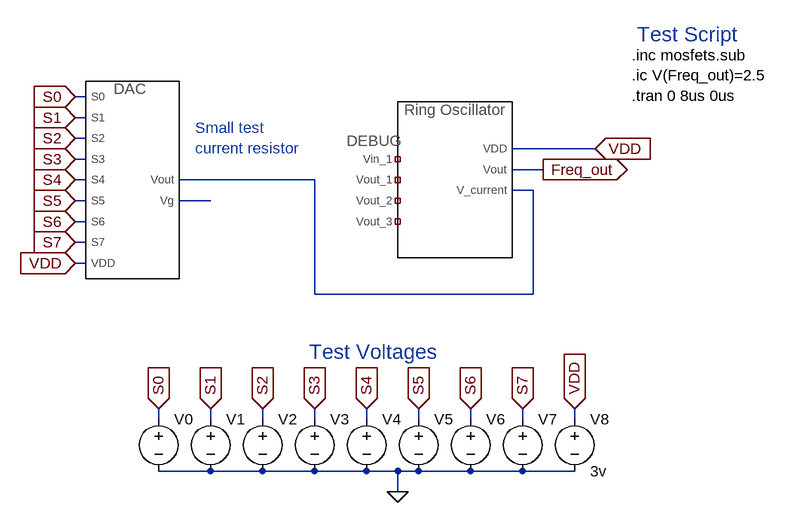
[diagram p0: schematic 0_winterg_assembly.asc]
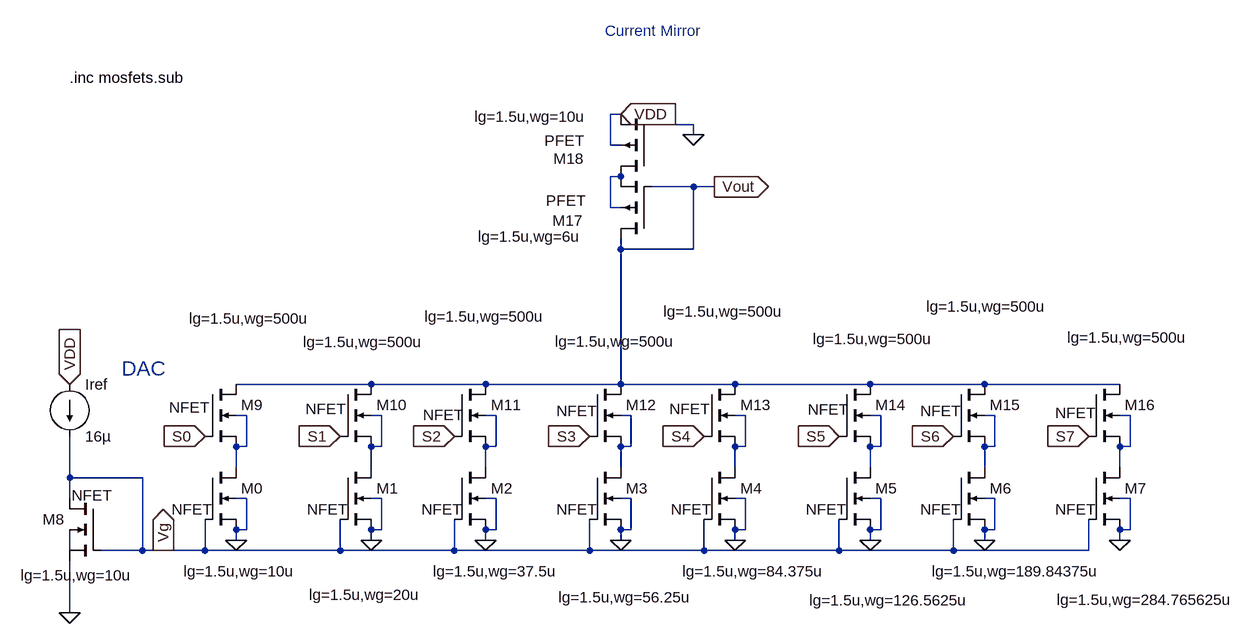
[diagram p1: sub-circuit 3_dac_winterg.asc]
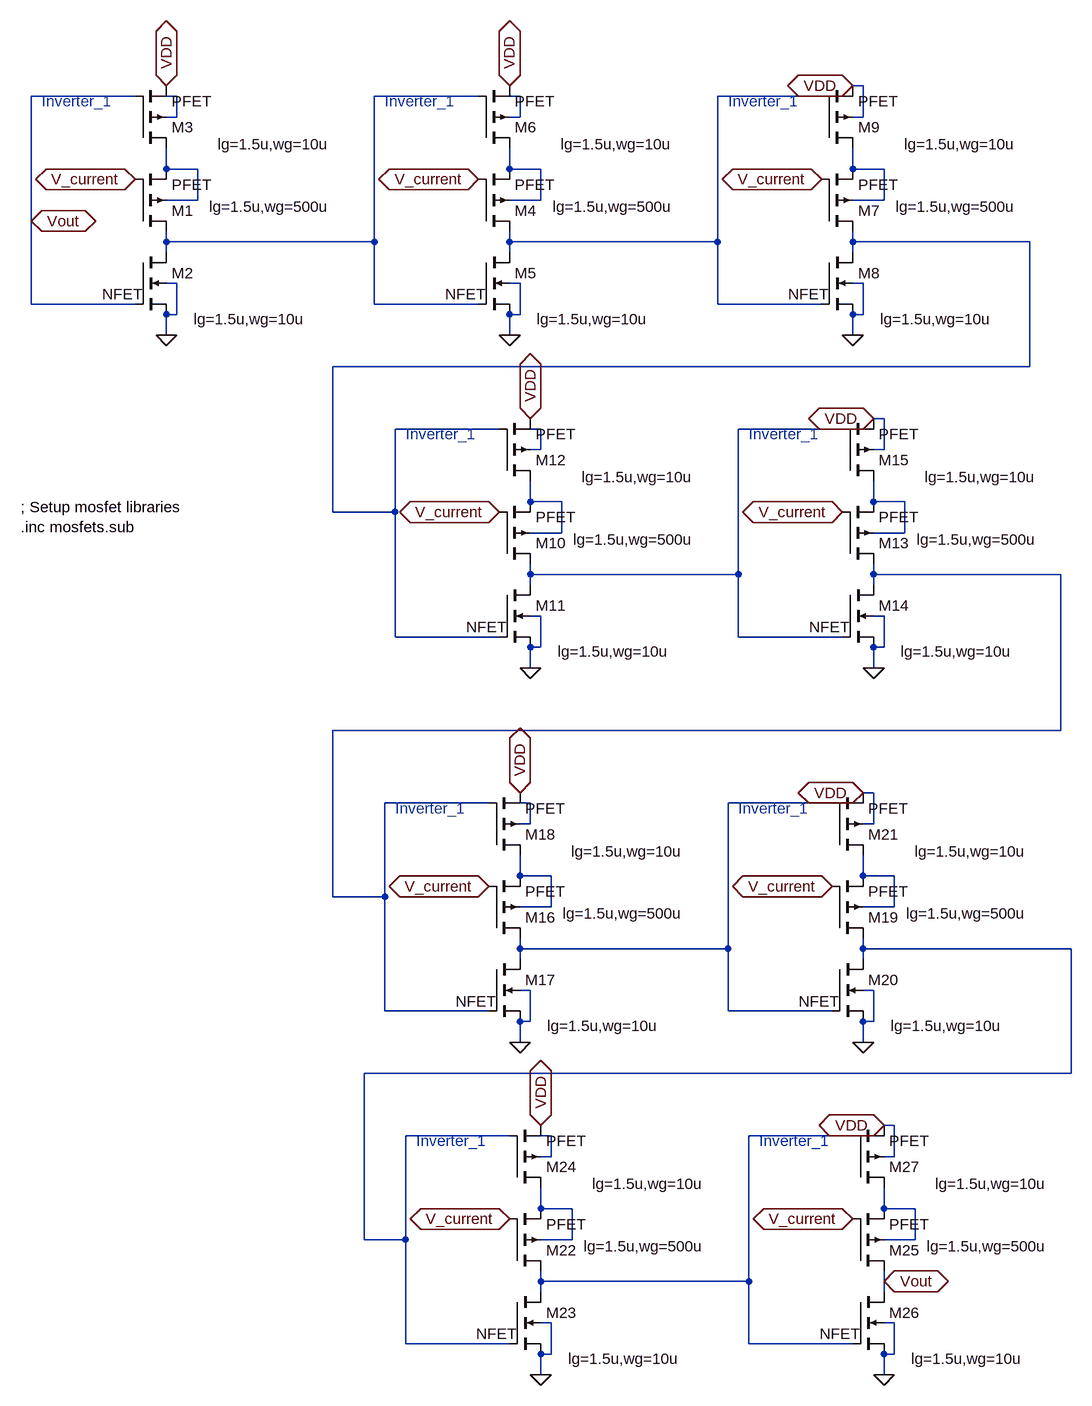
[diagram p2: sub-circuit 2_oscillator_winterg.asc]
0_winterg_assembly.asc, the LTspice schematic file:
Version 4
SHEET 1 1016 1228
WIRE -176 272 -192 272
WIRE -176 304 -192 304
WIRE -176 336 -192 336
WIRE 608 352 480 352
WIRE -176 368 -192 368
WIRE 528 384 480 384
WIRE -176 400 -192 400
WIRE 176 400 -32 400
WIRE 512 416 480 416
WIRE -176 432 -192 432
WIRE 16 432 -32 432
WIRE -176 464 -192 464
WIRE -176 496 -192 496
WIRE -176 528 -192 528
WIRE 176 576 176 400
WIRE 512 576 512 416
WIRE 512 576 176 576
WIRE -64 768 -64 752
WIRE 16 768 16 752
WIRE 96 768 96 752
WIRE 176 768 176 752
WIRE 256 768 256 752
WIRE 336 768 336 752
WIRE 416 768 416 752
WIRE 496 768 496 752
WIRE 576 768 576 752
WIRE 16 848 -64 848
WIRE 96 848 16 848
WIRE 176 848 96 848
WIRE 256 848 176 848
WIRE 304 848 256 848
WIRE 336 848 304 848
WIRE 416 848 336 848
WIRE 496 848 416 848
WIRE 576 848 496 848
WIRE 304 880 304 848
FLAG -192 528 VDD
IOPIN -192 528 In
FLAG 608 352 VDD
IOPIN 608 352 In
FLAG 528 384 Freq_out
IOPIN 528 384 Out
FLAG -192 496 S7
IOPIN -192 496 In
FLAG -192 464 S6
IOPIN -192 464 In
FLAG -192 432 S5
IOPIN -192 432 In
FLAG -192 400 S4
IOPIN -192 400 In
FLAG -192 368 S3
IOPIN -192 368 In
FLAG -192 336 S2
IOPIN -192 336 In
FLAG -192 304 S1
IOPIN -192 304 In
FLAG -192 272 S0
IOPIN -192 272 In
FLAG 304 880 0
FLAG 576 752 VDD
IOPIN 576 752 In
FLAG -64 752 S0
IOPIN -64 752 In
FLAG 16 752 S1
IOPIN 16 752 In
FLAG 96 752 S2
IOPIN 96 752 In
FLAG 176 752 S3
IOPIN 176 752 In
FLAG 256 752 S4
IOPIN 256 752 In
FLAG 336 752 S5
IOPIN 336 752 In
FLAG 416 752 S6
IOPIN 416 752 In
FLAG 496 752 S7
IOPIN 496 752 In
SYMBOL 3_DAC_winterg -112 400 R0
WINDOW 0 8 -152 Invisible 2
WINDOW 39 -27 165 Left 2
SYMATTR InstName X1
SYMBOL 2_oscillator_winterg 384 400 R0
WINDOW 0 8 -120 Invisible 2
SYMATTR InstName X2
SYMBOL voltage -64 752 R0
WINDOW 3 24 38 Invisible 2
SYMATTR Value PULSE(0 3 0 1ns 1ns 1us 0.0 1)
SYMATTR InstName V0
SYMBOL voltage 16 752 R0
WINDOW 3 24 96 Invisible 2
SYMATTR Value PULSE(0 3 1us 1ns 1ns 1us 0 1)
SYMATTR InstName V1
SYMBOL voltage 96 752 R0
WINDOW 3 24 96 Invisible 2
SYMATTR Value PULSE(0 3 2us 1ns 1ns 1us 0 1)
SYMATTR InstName V2
SYMBOL voltage 176 752 R0
WINDOW 3 24 96 Invisible 2
SYMATTR Value PULSE(0 3 3us 1ns 1ns 1us 0 1)
SYMATTR InstName V3
SYMBOL voltage 256 752 R0
WINDOW 3 24 96 Invisible 2
SYMATTR Value PULSE(0 3 4us 1ns 1ns 1us 0 1)
SYMATTR InstName V4
SYMBOL voltage 336 752 R0
WINDOW 3 24 96 Invisible 2
SYMATTR InstName V5
SYMATTR Value PULSE(0 3 5us 1ns 1ns 1us 0 1)
SYMBOL voltage 416 752 R0
WINDOW 3 24 96 Invisible 2
SYMATTR InstName V6
SYMATTR Value PULSE(0 3 6us 1ns 1ns 1us 0 1)
SYMBOL voltage 496 752 R0
WINDOW 3 24 96 Invisible 2
SYMATTR InstName V7
SYMATTR Value PULSE(0 3 7us 1ns 1ns 1us 0 1)
SYMBOL voltage 576 752 R0
SYMATTR InstName V8
SYMATTR Value 3v
SYMATTR SpiceLine Rser=0
TEXT 664 208 Left 2 !.inc mosfets.sub\n.ic V(Freq_out)=2.5\n.tran 0 8us 0us
TEXT 168 664 Left 3 ;Test Voltages
TEXT 672 176 Left 3 ;Test Script
TEXT -8 320 Left 2 ;Small test\ncurrent resistor

3_dac_winterg.asc, the sub-circuit schematic file:
Version 4
SHEET 1 1748 680
WIRE 784 -240 768 -240
WIRE 896 -224 832 -224
WIRE 896 -208 896 -224
WIRE 768 -192 768 -240
WIRE 784 -192 768 -192
WIRE 784 -144 768 -144
WIRE 896 -128 832 -128
WIRE 928 -128 896 -128
WIRE 768 -96 768 -144
WIRE 784 -96 768 -96
WIRE 784 -32 784 -48
WIRE 896 -32 896 -128
WIRE 896 -32 784 -32
WIRE 400 176 192 176
WIRE 576 176 400 176
WIRE 784 176 784 -32
WIRE 784 176 576 176
WIRE 960 176 784 176
WIRE 1168 176 960 176
WIRE 1344 176 1168 176
WIRE 1552 176 1344 176
WIRE 208 224 192 224
WIRE 416 224 400 224
WIRE 592 224 576 224
WIRE 800 224 784 224
WIRE 976 224 960 224
WIRE 1184 224 1168 224
WIRE 1360 224 1344 224
WIRE 1568 224 1552 224
WIRE 208 272 208 224
WIRE 208 272 192 272
WIRE 416 272 416 224
WIRE 416 272 400 272
WIRE 592 272 592 224
WIRE 592 272 576 272
WIRE 800 272 800 224
WIRE 800 272 784 272
WIRE 976 272 976 224
WIRE 976 272 960 272
WIRE 1184 272 1184 224
WIRE 1184 272 1168 272
WIRE 1360 272 1360 224
WIRE 1360 272 1344 272
WIRE 1568 272 1568 224
WIRE 1568 272 1552 272
WIRE 192 304 192 272
WIRE 400 304 400 272
WIRE 576 304 576 272
WIRE 784 304 784 272
WIRE 960 304 960 272
WIRE 1168 304 1168 272
WIRE 1344 304 1344 272
WIRE 1552 304 1552 272
WIRE -64 320 -64 256
WIRE 48 320 -64 320
WIRE -64 352 -64 320
WIRE 208 352 192 352
WIRE 416 352 400 352
WIRE 592 352 576 352
WIRE 800 352 784 352
WIRE 976 352 960 352
WIRE 1184 352 1168 352
WIRE 1360 352 1344 352
WIRE 1568 352 1552 352
WIRE 208 400 208 352
WIRE 208 400 192 400
WIRE 416 400 416 352
WIRE 416 400 400 400
WIRE 592 400 592 352
WIRE 592 400 576 400
WIRE 800 400 800 352
WIRE 800 400 784 400
WIRE 976 400 976 352
WIRE 976 400 960 400
WIRE 1184 400 1184 352
WIRE 1184 400 1168 400
WIRE 1360 400 1360 352
WIRE 1360 400 1344 400
WIRE 1568 400 1568 352
WIRE 1568 400 1552 400
WIRE 192 416 192 400
WIRE 208 416 192 416
WIRE 400 416 400 400
WIRE 576 416 576 400
WIRE 784 416 784 400
WIRE 960 416 960 400
WIRE 1168 416 1168 400
WIRE 1344 416 1344 400
WIRE 1552 416 1552 400
WIRE -64 432 -64 400
WIRE 48 432 48 320
WIRE 48 432 -16 432
WIRE 80 432 48 432
WIRE 144 432 144 384
WIRE 144 432 80 432
WIRE 352 432 352 384
WIRE 352 432 144 432
WIRE 528 432 528 384
WIRE 528 432 352 432
WIRE 736 432 736 384
WIRE 736 432 528 432
WIRE 912 432 912 384
WIRE 912 432 736 432
WIRE 1120 432 1120 384
WIRE 1120 432 912 432
WIRE 1296 432 1296 384
WIRE 1296 432 1120 432
WIRE 1504 432 1504 384
WIRE 1504 432 1296 432
WIRE -64 528 -64 448
FLAG -64 176 VDD
IOPIN -64 176 In
FLAG -64 528 0
FLAG 192 416 0
FLAG 400 416 0
FLAG 576 416 0
FLAG 784 416 0
FLAG 960 416 0
FLAG 1168 416 0
FLAG 1344 416 0
FLAG 1552 416 0
FLAG 144 256 S0
IOPIN 144 256 In
FLAG 352 256 S1
IOPIN 352 256 In
FLAG 528 256 S2
IOPIN 528 256 In
FLAG 736 256 S3
IOPIN 736 256 In
FLAG 912 256 S4
IOPIN 912 256 In
FLAG 1120 256 S5
IOPIN 1120 256 In
FLAG 1296 256 S6
IOPIN 1296 256 In
FLAG 1504 256 S7
IOPIN 1504 256 In
FLAG 928 -128 Vout
IOPIN 928 -128 Out
FLAG 784 -240 VDD
IOPIN 784 -240 In
FLAG 896 -208 0
FLAG 80 432 Vg
IOPIN 80 432 Out
SYMBOL current -64 176 R0
SYMATTR InstName Iref
SYMATTR Value 16µ
SYMBOL nmos4 -16 352 M0
WINDOW 123 -49 118 Left 2
WINDOW 3 -18 -5 Left 2
SYMATTR Value2 lg=1.5u,wg=10u
SYMATTR Value NFET
SYMATTR InstName M8
SYMATTR Prefix X
SYMBOL nmos4 144 304 R0
WINDOW 123 -33 160 Left 2
WINDOW 3 -51 65 Left 2
SYMATTR Value2 lg=1.5u,wg=10u
SYMATTR Value NFET
SYMATTR InstName M0
SYMATTR Prefix X
SYMBOL nmos4 352 304 R0
WINDOW 123 -48 196 Left 2
WINDOW 3 -51 65 Left 2
SYMATTR Value2 lg=1.5u,wg=20u
SYMATTR Value NFET
SYMATTR InstName M1
SYMATTR Prefix X
SYMBOL nmos4 528 304 R0
WINDOW 123 -33 160 Left 2
WINDOW 3 -51 65 Left 2
SYMATTR Value2 lg=1.5u,wg=37.5u
SYMATTR Value NFET
SYMATTR InstName M2
SYMATTR Prefix X
SYMBOL nmos4 736 304 R0
WINDOW 123 -48 200 Left 2
WINDOW 3 -51 65 Left 2
SYMATTR Value2 lg=1.5u,wg=56.25u
SYMATTR Value NFET
SYMATTR InstName M3
SYMATTR Prefix X
SYMBOL nmos4 912 304 R0
WINDOW 123 -33 160 Left 2
WINDOW 3 -51 65 Left 2
SYMATTR Value2 lg=1.5u,wg=84.375u
SYMATTR Value NFET
SYMATTR InstName M4
SYMATTR Prefix X
SYMBOL nmos4 1120 304 R0
WINDOW 123 -46 205 Left 2
WINDOW 3 -51 65 Left 2
SYMATTR Value2 lg=1.5u,wg=126.5625u
SYMATTR Value NFET
SYMATTR InstName M5
SYMATTR Prefix X
SYMBOL nmos4 1296 304 R0
WINDOW 123 -33 160 Left 2
WINDOW 3 -51 65 Left 2
SYMATTR Value2 lg=1.5u,wg=189.84375u
SYMATTR Value NFET
SYMATTR InstName M6
SYMATTR Prefix X
SYMBOL nmos4 1504 304 R0
WINDOW 123 -49 204 Left 2
WINDOW 3 -51 65 Left 2
SYMATTR Value2 lg=1.5u,wg=284.765625u
SYMATTR Value NFET
SYMATTR InstName M7
SYMATTR Prefix X
SYMBOL nmos4 144 176 R0
WINDOW 123 -24 -101 Left 2
WINDOW 3 -55 36 Left 2
SYMATTR Value2 lg=1.5u,wg=500u
SYMATTR Value NFET
SYMATTR InstName M9
SYMATTR Prefix X
SYMBOL nmos4 352 176 R0
WINDOW 123 -57 -65 Left 2
WINDOW 3 -53 38 Left 2
SYMATTR Value2 lg=1.5u,wg=500u
SYMATTR Value NFET
SYMATTR InstName M10
SYMATTR Prefix X
SYMBOL nmos4 528 176 R0
WINDOW 123 -46 -104 Left 2
WINDOW 3 -48 47 Left 2
SYMATTR Value2 lg=1.5u,wg=500u
SYMATTR Value NFET
SYMATTR InstName M11
SYMATTR Prefix X
SYMBOL nmos4 736 176 R0
WINDOW 123 -53 -66 Left 2
WINDOW 3 -51 41 Left 2
SYMATTR Value2 lg=1.5u,wg=500u
SYMATTR Value NFET
SYMATTR InstName M12
SYMATTR Prefix X
SYMBOL nmos4 912 176 R0
WINDOW 123 -62 -112 Left 2
WINDOW 3 -53 38 Left 2
SYMATTR Value2 lg=1.5u,wg=500u
SYMATTR Value NFET
SYMATTR InstName M13
SYMATTR Prefix X
SYMBOL nmos4 1120 176 R0
WINDOW 123 -40 -70 Left 2
WINDOW 3 -48 39 Left 2
SYMATTR Value2 lg=1.5u,wg=500u
SYMATTR Value NFET
SYMATTR InstName M14
SYMATTR Prefix X
SYMBOL nmos4 1296 176 R0
WINDOW 123 -42 -120 Left 2
WINDOW 3 -51 41 Left 2
SYMATTR Value2 lg=1.5u,wg=500u
SYMATTR Value NFET
SYMATTR InstName M15
SYMATTR Prefix X
SYMBOL nmos4 1504 176 R0
WINDOW 123 -33 -72 Left 2
WINDOW 3 -51 44 Left 2
SYMATTR Value2 lg=1.5u,wg=500u
SYMATTR Value NFET
SYMATTR InstName M16
SYMATTR Prefix X
SYMBOL pmos4 832 -48 R180
WINDOW 123 109 3 Left 2
WINDOW 0 106 28 Left 2
WINDOW 3 102 59 Left 2
SYMATTR Value2 lg=1.5u,wg=6u
SYMATTR InstName M17
SYMATTR Value PFET
SYMATTR Prefix X
SYMBOL pmos4 832 -144 R180
WINDOW 123 101 92 Left 2
WINDOW 0 104 27 Left 2
WINDOW 3 104 55 Left 2
SYMATTR Value2 lg=1.5u,wg=10u
SYMATTR InstName M18
SYMATTR Value PFET
SYMATTR Prefix X
TEXT -64 -296 Left 2 !.inc mosfets.sub
TEXT 760 -368 Left 2 ;Current Mirror
TEXT 16 152 Left 3 ;DAC

2_oscillator_winterg.asc, the sub-circuit schematic file:
Version 4
SHEET 1 2644 1360
WIRE 896 -640 880 -640
WIRE -224 -624 -384 -624
WIRE -160 -624 -176 -624
WIRE 304 -624 144 -624
WIRE 352 -624 352 -640
WIRE 368 -624 352 -624
WIRE 832 -624 672 -624
WIRE -160 -592 -160 -624
WIRE -160 -592 -176 -592
WIRE 368 -592 368 -624
WIRE 368 -592 352 -592
WIRE 896 -592 896 -640
WIRE 896 -592 880 -592
WIRE -176 -512 -176 -544
WIRE -128 -512 -176 -512
WIRE 352 -512 352 -544
WIRE 400 -512 352 -512
WIRE 880 -512 880 -544
WIRE 928 -512 880 -512
WIRE -128 -464 -128 -512
WIRE -128 -464 -176 -464
WIRE 400 -464 400 -512
WIRE 400 -464 352 -464
WIRE 928 -464 928 -512
WIRE 928 -464 880 -464
WIRE -384 -432 -384 -624
WIRE -176 -400 -176 -416
WIRE 144 -400 144 -624
WIRE 144 -400 -176 -400
WIRE 352 -400 352 -416
WIRE 672 -400 672 -624
WIRE 672 -400 352 -400
WIRE 880 -400 880 -416
WIRE 1152 -400 880 -400
WIRE -176 -384 -176 -400
WIRE 352 -384 352 -400
WIRE 880 -384 880 -400
WIRE -160 -336 -176 -336
WIRE 368 -336 352 -336
WIRE 896 -336 880 -336
WIRE -384 -304 -384 -432
WIRE -224 -304 -384 -304
WIRE 144 -304 144 -400
WIRE 304 -304 144 -304
WIRE 672 -304 672 -400
WIRE 832 -304 672 -304
WIRE -160 -288 -160 -336
WIRE -160 -288 -176 -288
WIRE 368 -288 368 -336
WIRE 368 -288 352 -288
WIRE 896 -288 896 -336
WIRE 896 -288 880 -288
WIRE -176 -256 -176 -288
WIRE 352 -256 352 -288
WIRE 880 -256 880 -288
WIRE 1152 -208 1152 -400
WIRE 1152 -208 80 -208
WIRE 928 -128 912 -128
WIRE 336 -112 176 -112
WIRE 384 -112 384 -128
WIRE 400 -112 384 -112
WIRE 864 -112 704 -112
WIRE 400 -80 400 -112
WIRE 400 -80 384 -80
WIRE 928 -80 928 -128
WIRE 928 -80 912 -80
WIRE 384 0 384 -32
WIRE 432 0 384 0
WIRE 912 0 912 -32
WIRE 960 0 912 0
WIRE 80 16 80 -208
WIRE 176 16 176 -112
WIRE 176 16 80 16
WIRE 432 48 432 0
WIRE 432 48 384 48
WIRE 960 48 960 0
WIRE 960 48 912 48
WIRE 384 112 384 96
WIRE 704 112 704 -112
WIRE 704 112 384 112
WIRE 912 112 912 96
WIRE 1200 112 912 112
WIRE 384 128 384 112
WIRE 912 128 912 112
WIRE 400 176 384 176
WIRE 928 176 912 176
WIRE 176 208 176 16
WIRE 336 208 176 208
WIRE 704 208 704 112
WIRE 864 208 704 208
WIRE 400 224 400 176
WIRE 400 224 384 224
WIRE 928 224 928 176
WIRE 928 224 912 224
WIRE 384 256 384 224
WIRE 912 256 912 224
WIRE 1200 352 1200 112
WIRE 1200 352 80 352
WIRE 912 448 896 448
WIRE 320 464 160 464
WIRE 368 464 368 448
WIRE 384 464 368 464
WIRE 848 464 688 464
WIRE 384 496 384 464
WIRE 384 496 368 496
WIRE 912 496 912 448
WIRE 912 496 896 496
WIRE 368 576 368 544
WIRE 416 576 368 576
WIRE 896 576 896 544
WIRE 944 576 896 576
WIRE 80 608 80 352
WIRE 160 608 160 464
WIRE 160 608 80 608
WIRE 416 624 416 576
WIRE 416 624 368 624
WIRE 944 624 944 576
WIRE 944 624 896 624
WIRE 368 688 368 672
WIRE 688 688 688 464
WIRE 688 688 368 688
WIRE 896 688 896 672
WIRE 1216 688 896 688
WIRE 368 704 368 688
WIRE 896 704 896 688
WIRE 384 752 368 752
WIRE 912 752 896 752
WIRE 160 784 160 608
WIRE 320 784 160 784
WIRE 688 784 688 688
WIRE 848 784 688 784
WIRE 384 800 384 752
WIRE 384 800 368 800
WIRE 912 800 912 752
WIRE 912 800 896 800
WIRE 368 832 368 800
WIRE 896 832 896 800
WIRE 1216 880 1216 688
WIRE 1216 880 128 880
WIRE 944 960 928 960
WIRE 352 976 192 976
WIRE 400 976 400 960
WIRE 416 976 400 976
WIRE 880 976 720 976
WIRE 416 1008 416 976
WIRE 416 1008 400 1008
WIRE 944 1008 944 960
WIRE 944 1008 928 1008
WIRE 400 1088 400 1056
WIRE 448 1088 400 1088
WIRE 928 1088 928 1056
WIRE 976 1088 928 1088
WIRE 128 1136 128 880
WIRE 192 1136 192 976
WIRE 192 1136 128 1136
WIRE 448 1136 448 1088
WIRE 448 1136 400 1136
WIRE 976 1136 976 1088
WIRE 976 1136 928 1136
WIRE 400 1200 400 1184
WIRE 720 1200 720 976
WIRE 720 1200 400 1200
WIRE 928 1200 928 1184
WIRE 400 1216 400 1200
WIRE 928 1216 928 1200
WIRE 416 1264 400 1264
WIRE 944 1264 928 1264
WIRE 192 1296 192 1136
WIRE 352 1296 192 1296
WIRE 720 1296 720 1200
WIRE 880 1296 720 1296
WIRE 416 1312 416 1264
WIRE 416 1312 400 1312
WIRE 944 1312 944 1264
WIRE 944 1312 928 1312
WIRE 400 1344 400 1312
WIRE 928 1344 928 1312
FLAG -176 -256 0
FLAG -176 -640 VDD
IOPIN -176 -640 BiDir
FLAG -224 -496 V_current
IOPIN -224 -496 BiDir
FLAG -384 -432 Vout
IOPIN -384 -432 BiDir
FLAG 352 -256 0
FLAG 352 -640 VDD
IOPIN 352 -640 BiDir
FLAG 304 -496 V_current
IOPIN 304 -496 BiDir
FLAG 880 -256 0
FLAG 880 -640 VDD
IOPIN 880 -640 BiDir
FLAG 832 -496 V_current
IOPIN 832 -496 BiDir
FLAG 384 256 0
FLAG 384 -128 VDD
IOPIN 384 -128 BiDir
FLAG 336 16 V_current
IOPIN 336 16 BiDir
FLAG 912 256 0
FLAG 912 -128 VDD
IOPIN 912 -128 BiDir
FLAG 864 16 V_current
IOPIN 864 16 BiDir
FLAG 368 832 0
FLAG 368 448 VDD
IOPIN 368 448 BiDir
FLAG 320 592 V_current
IOPIN 320 592 BiDir
FLAG 896 832 0
FLAG 896 448 VDD
IOPIN 896 448 BiDir
FLAG 848 592 V_current
IOPIN 848 592 BiDir
FLAG 928 1200 Vout
IOPIN 928 1200 BiDir
FLAG 400 1344 0
FLAG 400 960 VDD
IOPIN 400 960 BiDir
FLAG 352 1104 V_current
IOPIN 352 1104 BiDir
FLAG 928 1344 0
FLAG 928 960 VDD
IOPIN 928 960 BiDir
FLAG 880 1104 V_current
IOPIN 880 1104 BiDir
SYMBOL pmos4 -224 -416 M180
WINDOW 123 114 38 Left 2
SYMATTR Value2 lg=1.5u,wg=500u
SYMATTR InstName M1
SYMATTR Value PFET
SYMATTR Prefix X
SYMBOL nmos4 -224 -384 R0
WINDOW 123 90 103 Left 2
WINDOW 3 -51 65 Left 2
SYMATTR Value2 lg=1.5u,wg=10u
SYMATTR Value NFET
SYMATTR InstName M2
SYMATTR Prefix X
SYMBOL pmos4 -224 -544 M180
WINDOW 123 127 6 Left 2
SYMATTR Value2 lg=1.5u,wg=10u
SYMATTR InstName M3
SYMATTR Value PFET
SYMATTR Prefix X
SYMBOL pmos4 304 -416 M180
WINDOW 123 114 38 Left 2
SYMATTR Value2 lg=1.5u,wg=500u
SYMATTR InstName M4
SYMATTR Value PFET
SYMATTR Prefix X
SYMBOL nmos4 304 -384 R0
WINDOW 123 90 103 Left 2
WINDOW 3 -51 65 Left 2
SYMATTR Value2 lg=1.5u,wg=10u
SYMATTR Value NFET
SYMATTR InstName M5
SYMATTR Prefix X
SYMBOL pmos4 304 -544 M180
WINDOW 123 127 6 Left 2
SYMATTR Value2 lg=1.5u,wg=10u
SYMATTR InstName M6
SYMATTR Value PFET
SYMATTR Prefix X
SYMBOL pmos4 832 -416 M180
WINDOW 123 114 38 Left 2
SYMATTR Value2 lg=1.5u,wg=500u
SYMATTR InstName M7
SYMATTR Value PFET
SYMATTR Prefix X
SYMBOL nmos4 832 -384 R0
WINDOW 123 90 103 Left 2
WINDOW 3 -51 65 Left 2
SYMATTR Value2 lg=1.5u,wg=10u
SYMATTR Value NFET
SYMATTR InstName M8
SYMATTR Prefix X
SYMBOL pmos4 832 -544 M180
WINDOW 123 127 6 Left 2
SYMATTR Value2 lg=1.5u,wg=10u
SYMATTR InstName M9
SYMATTR Value PFET
SYMATTR Prefix X
SYMBOL pmos4 336 96 M180
WINDOW 123 114 38 Left 2
SYMATTR Value2 lg=1.5u,wg=500u
SYMATTR InstName M10
SYMATTR Value PFET
SYMATTR Prefix X
SYMBOL nmos4 336 128 R0
WINDOW 123 90 103 Left 2
WINDOW 3 -51 65 Left 2
SYMATTR Value2 lg=1.5u,wg=10u
SYMATTR Value NFET
SYMATTR InstName M11
SYMATTR Prefix X
SYMBOL pmos4 336 -32 M180
WINDOW 123 127 6 Left 2
SYMATTR Value2 lg=1.5u,wg=10u
SYMATTR InstName M12
SYMATTR Value PFET
SYMATTR Prefix X
SYMBOL pmos4 864 96 M180
WINDOW 123 114 38 Left 2
SYMATTR Value2 lg=1.5u,wg=500u
SYMATTR InstName M13
SYMATTR Value PFET
SYMATTR Prefix X
SYMBOL nmos4 864 128 R0
WINDOW 123 90 103 Left 2
WINDOW 3 -51 65 Left 2
SYMATTR Value2 lg=1.5u,wg=10u
SYMATTR Value NFET
SYMATTR InstName M14
SYMATTR Prefix X
SYMBOL pmos4 864 -32 M180
WINDOW 123 127 6 Left 2
SYMATTR Value2 lg=1.5u,wg=10u
SYMATTR InstName M15
SYMATTR Value PFET
SYMATTR Prefix X
SYMBOL pmos4 320 672 M180
WINDOW 123 114 38 Left 2
SYMATTR Value2 lg=1.5u,wg=500u
SYMATTR InstName M16
SYMATTR Value PFET
SYMATTR Prefix X
SYMBOL nmos4 320 704 R0
WINDOW 123 90 103 Left 2
WINDOW 3 -51 65 Left 2
SYMATTR Value2 lg=1.5u,wg=10u
SYMATTR Value NFET
SYMATTR InstName M17
SYMATTR Prefix X
SYMBOL pmos4 320 544 M180
WINDOW 123 127 6 Left 2
SYMATTR Value2 lg=1.5u,wg=10u
SYMATTR InstName M18
SYMATTR Value PFET
SYMATTR Prefix X
SYMBOL pmos4 848 672 M180
WINDOW 123 114 38 Left 2
SYMATTR Value2 lg=1.5u,wg=500u
SYMATTR InstName M19
SYMATTR Value PFET
SYMATTR Prefix X
SYMBOL nmos4 848 704 R0
WINDOW 123 90 103 Left 2
WINDOW 3 -51 65 Left 2
SYMATTR Value2 lg=1.5u,wg=10u
SYMATTR Value NFET
SYMATTR InstName M20
SYMATTR Prefix X
SYMBOL pmos4 848 544 M180
WINDOW 123 127 6 Left 2
SYMATTR Value2 lg=1.5u,wg=10u
SYMATTR InstName M21
SYMATTR Value PFET
SYMATTR Prefix X
SYMBOL pmos4 352 1184 M180
WINDOW 123 114 38 Left 2
SYMATTR Value2 lg=1.5u,wg=500u
SYMATTR InstName M22
SYMATTR Value PFET
SYMATTR Prefix X
SYMBOL nmos4 352 1216 R0
WINDOW 123 90 103 Left 2
WINDOW 3 -51 65 Left 2
SYMATTR Value2 lg=1.5u,wg=10u
SYMATTR Value NFET
SYMATTR InstName M23
SYMATTR Prefix X
SYMBOL pmos4 352 1056 M180
WINDOW 123 127 6 Left 2
SYMATTR Value2 lg=1.5u,wg=10u
SYMATTR InstName M24
SYMATTR Value PFET
SYMATTR Prefix X
SYMBOL pmos4 880 1184 M180
WINDOW 123 114 38 Left 2
SYMATTR Value2 lg=1.5u,wg=500u
SYMATTR InstName M25
SYMATTR Value PFET
SYMATTR Prefix X
SYMBOL nmos4 880 1216 R0
WINDOW 123 90 103 Left 2
WINDOW 3 -51 65 Left 2
SYMATTR Value2 lg=1.5u,wg=10u
SYMATTR Value NFET
SYMATTR InstName M26
SYMATTR Prefix X
SYMBOL pmos4 880 1056 M180
WINDOW 123 127 6 Left 2
SYMATTR Value2 lg=1.5u,wg=10u
SYMATTR InstName M27
SYMATTR Value PFET
SYMATTR Prefix X
TEXT -400 8 Left 2 !; Setup mosfet libraries\n.inc mosfets.sub
TEXT -368 -616 Left 2 ;Inverter_1
TEXT 160 -616 Left 2 ;Inverter_1
TEXT 688 -616 Left 2 ;Inverter_1
TEXT 192 -104 Left 2 ;Inverter_1
TEXT 720 -104 Left 2 ;Inverter_1
TEXT 176 472 Left 2 ;Inverter_1
TEXT 704 472 Left 2 ;Inverter_1
TEXT 208 984 Left 2 ;Inverter_1
TEXT 736 984 Left 2 ;Inverter_1

The netlist it stands for:
* 0_winterg_assembly.asc
XX1 S0 S1 S2 S3 S4 S5 S6 S7 VDD N001 N002 3_dac_winterg
XX2 N001 VDD NC_01 Freq_out NC_02 NC_03 NC_04 2_oscillator_winterg
V0 S0 0 PULSE(0 3 0 1ns 1ns 1us 0.0 1)
V1 S1 0 PULSE(0 3 1us 1ns 1ns 1us 0 1)
V2 S2 0 PULSE(0 3 2us 1ns 1ns 1us 0 1)
V3 S3 0 PULSE(0 3 3us 1ns 1ns 1us 0 1)
V4 S4 0 PULSE(0 3 4us 1ns 1ns 1us 0 1)
V5 S5 0 PULSE(0 3 5us 1ns 1ns 1us 0 1)
V6 S6 0 PULSE(0 3 6us 1ns 1ns 1us 0 1)
V7 S7 0 PULSE(0 3 7us 1ns 1ns 1us 0 1)
V8 VDD 0 3v Rser=0

* block symbol definitions
.subckt 3_dac_winterg S0 S1 S2 S3 S4 S5 S6 S7 VDD Vout Vg
Iref VDD Vg 16µ
XM8 Vg Vg 0 N010 NFET lg=1.5u,wg=10u  ; pins D G S B
XM0 N002 Vg 0 0 NFET lg=1.5u,wg=10u  ; pins D G S B
XM1 N003 Vg 0 0 NFET lg=1.5u,wg=20u  ; pins D G S B
XM2 N004 Vg 0 0 NFET lg=1.5u,wg=37.5u  ; pins D G S B
XM3 N005 Vg 0 0 NFET lg=1.5u,wg=56.25u  ; pins D G S B
XM4 N006 Vg 0 0 NFET lg=1.5u,wg=84.375u  ; pins D G S B
XM5 N007 Vg 0 0 NFET lg=1.5u,wg=126.5625u  ; pins D G S B
XM6 N008 Vg 0 0 NFET lg=1.5u,wg=189.84375u  ; pins D G S B
XM7 N009 Vg 0 0 NFET lg=1.5u,wg=284.765625u  ; pins D G S B
XM9 Vout S0 N002 N002 NFET lg=1.5u,wg=500u  ; pins D G S B
XM10 Vout S1 N003 N003 NFET lg=1.5u,wg=500u  ; pins D G S B
XM11 Vout S2 N004 N004 NFET lg=1.5u,wg=500u  ; pins D G S B
XM12 Vout S3 N005 N005 NFET lg=1.5u,wg=500u  ; pins D G S B
XM13 Vout S4 N006 N006 NFET lg=1.5u,wg=500u  ; pins D G S B
XM14 Vout S5 N007 N007 NFET lg=1.5u,wg=500u  ; pins D G S B
XM15 Vout S6 N008 N008 NFET lg=1.5u,wg=500u  ; pins D G S B
XM16 Vout S7 N009 N009 NFET lg=1.5u,wg=500u  ; pins D G S B
XM17 Vout Vout N001 N001 PFET lg=1.5u,wg=6u  ; pins D G S B
XM18 N001 0 VDD VDD PFET lg=1.5u,wg=10u  ; pins D G S B
.inc mosfets.sub
* Current Mirror
* DAC
.ends 3_dac_winterg

.subckt 2_oscillator_winterg V_current VDD Vin_1 Vout Vout_1 Vout_2 Vout_3
XM1 N002 V_current N004 N004 PFET lg=1.5u,wg=500u  ; pins D G S B
XM2 N002 Vout 0 0 NFET lg=1.5u,wg=10u  ; pins D G S B
XM3 N004 Vout VDD N001 PFET lg=1.5u,wg=10u  ; pins D G S B
XM4 N003 V_current N005 N005 PFET lg=1.5u,wg=500u  ; pins D G S B
XM5 N003 N002 0 0 NFET lg=1.5u,wg=10u  ; pins D G S B
XM6 N005 N002 VDD VDD PFET lg=1.5u,wg=10u  ; pins D G S B
XM7 N007 V_current N006 N006 PFET lg=1.5u,wg=500u  ; pins D G S B
XM8 N007 N003 0 0 NFET lg=1.5u,wg=10u  ; pins D G S B
XM9 N006 N003 VDD VDD PFET lg=1.5u,wg=10u  ; pins D G S B
XM10 N008 V_current N009 N009 PFET lg=1.5u,wg=500u  ; pins D G S B
XM11 N008 N007 0 0 NFET lg=1.5u,wg=10u  ; pins D G S B
XM12 N009 N007 VDD VDD PFET lg=1.5u,wg=10u  ; pins D G S B
XM13 N011 V_current N010 N010 PFET lg=1.5u,wg=500u  ; pins D G S B
XM14 N011 N008 0 0 NFET lg=1.5u,wg=10u  ; pins D G S B
XM15 N010 N008 VDD VDD PFET lg=1.5u,wg=10u  ; pins D G S B
XM16 N012 V_current N013 N013 PFET lg=1.5u,wg=500u  ; pins D G S B
XM17 N012 N011 0 0 NFET lg=1.5u,wg=10u  ; pins D G S B
XM18 N013 N011 VDD VDD PFET lg=1.5u,wg=10u  ; pins D G S B
XM19 N015 V_current N014 N014 PFET lg=1.5u,wg=500u  ; pins D G S B
XM20 N015 N012 0 0 NFET lg=1.5u,wg=10u  ; pins D G S B
XM21 N014 N012 VDD VDD PFET lg=1.5u,wg=10u  ; pins D G S B
XM22 N016 V_current N017 N017 PFET lg=1.5u,wg=500u  ; pins D G S B
XM23 N016 N015 0 0 NFET lg=1.5u,wg=10u  ; pins D G S B
XM24 N017 N015 VDD VDD PFET lg=1.5u,wg=10u  ; pins D G S B
XM25 Vout V_current N018 N018 PFET lg=1.5u,wg=500u  ; pins D G S B
XM26 Vout N016 0 0 NFET lg=1.5u,wg=10u  ; pins D G S B
XM27 N018 N016 VDD VDD PFET lg=1.5u,wg=10u  ; pins D G S B
; Setup mosfet libraries
.inc mosfets.sub
* Inverter_1
* Inverter_1
* Inverter_1
* Inverter_1
* Inverter_1
* Inverter_1
* Inverter_1
* Inverter_1
* Inverter_1
.ends 2_oscillator_winterg

.inc mosfets.sub
.ic V(Freq_out)=2.5
.tran 0 8us 0us
* Test Voltages
* Test Script
* Small test
* current resistor
.backanno
.end